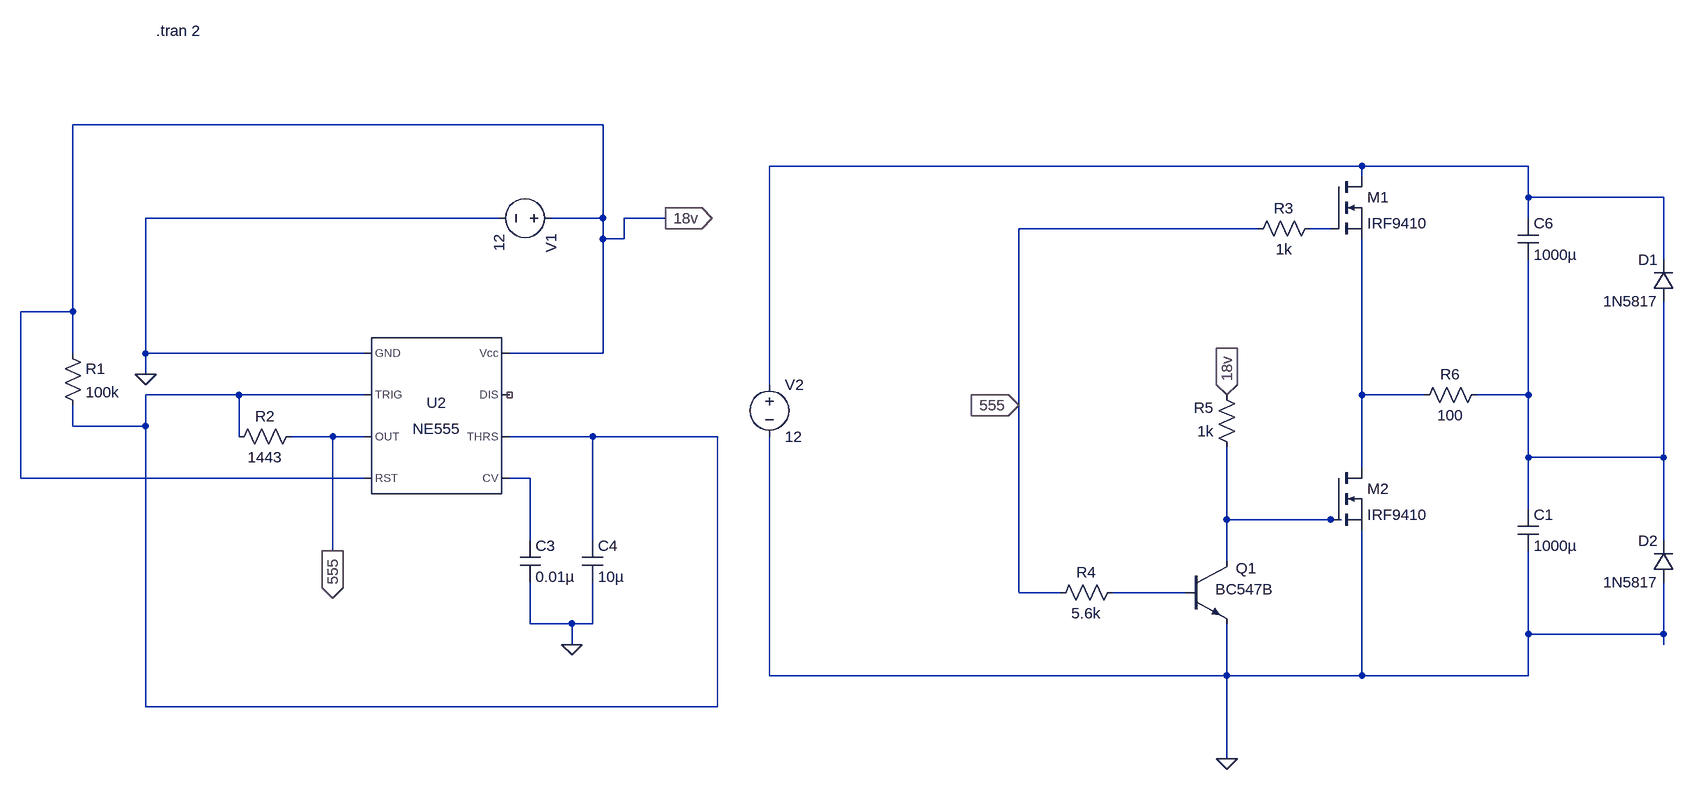
[diagram p0: schematic Half Bridge.asc]
Half Bridge.asc, the LTspice schematic file:
Version 4.1
SHEET 1 5032 2100
WIRE 1312 -320 496 -320
WIRE 2480 -256 1568 -256
WIRE 2736 -256 2480 -256
WIRE 2480 -240 2480 -256
WIRE 2736 -208 2736 -256
WIRE 2944 -208 2736 -208
WIRE 1152 -176 608 -176
WIRE 1312 -176 1312 -320
WIRE 1312 -176 1232 -176
WIRE 1408 -176 1344 -176
WIRE 2736 -176 2736 -208
WIRE 2320 -160 1952 -160
WIRE 2432 -160 2400 -160
WIRE 1312 -144 1312 -176
WIRE 1344 -144 1344 -176
WIRE 1344 -144 1312 -144
WIRE 2944 -112 2944 -208
WIRE 496 -32 496 -320
WIRE 496 -32 416 -32
WIRE 496 32 496 -32
WIRE 608 32 608 -176
WIRE 944 32 608 32
WIRE 1312 32 1312 -144
WIRE 1312 32 1168 32
WIRE 608 64 608 32
WIRE 1568 80 1568 -256
WIRE 752 96 608 96
WIRE 944 96 752 96
WIRE 2480 96 2480 -144
WIRE 2576 96 2480 96
WIRE 2736 96 2736 -112
WIRE 2736 96 2656 96
WIRE 1952 112 1952 -160
WIRE 496 144 496 112
WIRE 608 144 608 96
WIRE 608 144 496 144
WIRE 752 160 752 96
WIRE 896 160 832 160
WIRE 944 160 896 160
WIRE 1296 160 1168 160
WIRE 1488 160 1296 160
WIRE 2736 192 2736 96
WIRE 2944 192 2944 -48
WIRE 2944 192 2736 192
WIRE 2480 208 2480 96
WIRE 416 224 416 -32
WIRE 944 224 416 224
WIRE 1200 224 1168 224
WIRE 2736 272 2736 192
WIRE 2272 288 2272 176
WIRE 2432 288 2272 288
WIRE 2448 288 2432 288
WIRE 1200 320 1200 224
WIRE 1296 320 1296 160
WIRE 2944 320 2944 192
WIRE 896 336 896 160
WIRE 2272 352 2272 288
WIRE 1952 400 1952 112
WIRE 2016 400 1952 400
WIRE 2208 400 2096 400
WIRE 1200 448 1200 384
WIRE 1264 448 1200 448
WIRE 1296 448 1296 384
WIRE 1296 448 1264 448
WIRE 2736 464 2736 336
WIRE 2944 464 2944 384
WIRE 2944 464 2736 464
WIRE 1264 480 1264 448
WIRE 2944 480 2944 464
WIRE 1568 528 1568 160
WIRE 2272 528 2272 448
WIRE 2272 528 1568 528
WIRE 2480 528 2480 304
WIRE 2480 528 2272 528
WIRE 2736 528 2736 464
WIRE 2736 528 2480 528
WIRE 608 576 608 144
WIRE 1488 576 1488 160
WIRE 1488 576 608 576
WIRE 2272 656 2272 528
FLAG 608 64 0
FLAG 1264 480 0
FLAG 2272 656 0
FLAG 896 336 555
IOPIN 896 336 Out
FLAG 1952 112 555
IOPIN 1952 112 In
FLAG 2272 96 18v
IOPIN 2272 96 In
FLAG 1408 -176 18v
IOPIN 1408 -176 Out
SYMBOL Misc\\NE555 1056 128 R0
SYMATTR InstName U2
SYMBOL res 848 144 R90
WINDOW 0 0 56 VBottom 2
WINDOW 3 32 56 VTop 2
SYMATTR InstName R2
SYMATTR Value 1443
SYMBOL res 480 16 R0
SYMATTR InstName R1
SYMATTR Value 100k
SYMBOL cap 1184 320 R0
SYMATTR InstName C3
SYMATTR Value 0.01µ
SYMBOL voltage 1248 -176 R90
WINDOW 123 0 0 Left 0
WINDOW 39 0 0 Left 0
SYMATTR InstName V1
SYMATTR Value 12
SYMBOL cap 1280 320 R0
SYMATTR InstName C4
SYMATTR Value 10µ
SYMBOL res 2416 -176 R90
WINDOW 0 0 56 VBottom 2
WINDOW 3 32 56 VTop 2
SYMATTR InstName R3
SYMATTR Value 1k
SYMBOL res 2112 384 R90
WINDOW 0 0 56 VBottom 2
WINDOW 3 32 56 VTop 2
SYMATTR InstName R4
SYMATTR Value 5.6k
SYMBOL res 2288 192 R180
WINDOW 0 36 76 Left 2
WINDOW 3 36 40 Left 2
SYMATTR InstName R5
SYMATTR Value 1k
SYMBOL nmos 2432 -240 R0
SYMATTR InstName M1
SYMATTR Value IRF9410
SYMBOL nmos 2432 208 R0
SYMATTR InstName M2
SYMATTR Value IRF9410
SYMBOL npn 2208 352 R0
WINDOW 0 78 11 Left 2
WINDOW 3 46 43 Left 2
SYMATTR InstName Q1
SYMATTR Value BC547B
SYMBOL diode 2960 -48 R180
WINDOW 0 24 64 Left 2
WINDOW 3 24 0 Left 2
SYMATTR InstName D1
SYMATTR Value 1N5817
SYMATTR Description Diode
SYMATTR Type diode
SYMBOL diode 2960 384 R180
WINDOW 0 24 64 Left 2
WINDOW 3 24 0 Left 2
SYMATTR InstName D2
SYMATTR Value 1N5817
SYMATTR Description Diode
SYMATTR Type diode
SYMBOL voltage 1568 64 R0
WINDOW 123 0 0 Left 0
WINDOW 39 0 0 Left 0
SYMATTR InstName V2
SYMATTR Value 12
SYMBOL res 2672 80 R90
WINDOW 0 0 56 VBottom 2
WINDOW 3 32 56 VTop 2
SYMATTR InstName R6
SYMATTR Value 100
SYMBOL cap 2720 -176 R0
WINDOW 3 24 56 Left 2
SYMATTR InstName C6
SYMATTR Value 1000µ
SYMATTR Description Capacitor
SYMATTR Type cap
SYMATTR SpiceLine V=6.3 Irms=760m Rser=0.09 Lser=0 mfg="Panasonic" pn="ECA0JFQ102" type="Al electrolytic"
SYMBOL cap 2720 272 R0
WINDOW 3 24 56 Left 2
SYMATTR InstName C1
SYMATTR Value 1000µ
SYMATTR Description Capacitor
SYMATTR Type cap
SYMATTR SpiceLine V=6.3 Irms=760m Rser=0.09 Lser=0 mfg="Panasonic" pn="ECA0JFQ102" type="Al electrolytic"
TEXT 624 -464 Left 2 !.tran 2

The netlist it stands for:
* Half Bridge.asc
X§U2 0 N003 555 18v N006 N003 NC_01 18v NE555  ; pins GND TRIG OUT RST CV THRS DIS Vcc
R2 555 N003 1443
R1 18v N003 100k
C3 N006 0 0.01µ
V1 18v 0 12
C4 N003 0 10µ
R3 N002 555 1k
R4 N008 555 5.6k
R5 N007 18v 1k
M1 N001 N002 N004 N004 IRF9410
M2 N004 N007 0 0 IRF9410
Q1 N007 N008 0 0 BC547B
D1 N005 N001 1N5817
D2 0 N005 1N5817
V2 N001 0 12
R6 N005 N004 100
C6 N001 N005 1000µ V=6.3 Irms=760m Rser=0.09 Lser=0 mfg="Panasonic" pn="ECA0JFQ102" type="Al electrolytic"
C1 N005 0 1000µ V=6.3 Irms=760m Rser=0.09 Lser=0 mfg="Panasonic" pn="ECA0JFQ102" type="Al electrolytic"
.model D D
.lib standard.dio
.model NPN NPN
.model PNP PNP
.lib standard.bjt
.model NMOS NMOS
.model PMOS PMOS
.lib standard.mos
.tran 2
.lib NE555.sub
.backanno
.end